# EAGLE schematic snarfb-reza_v00 (EAGLE 6.4)
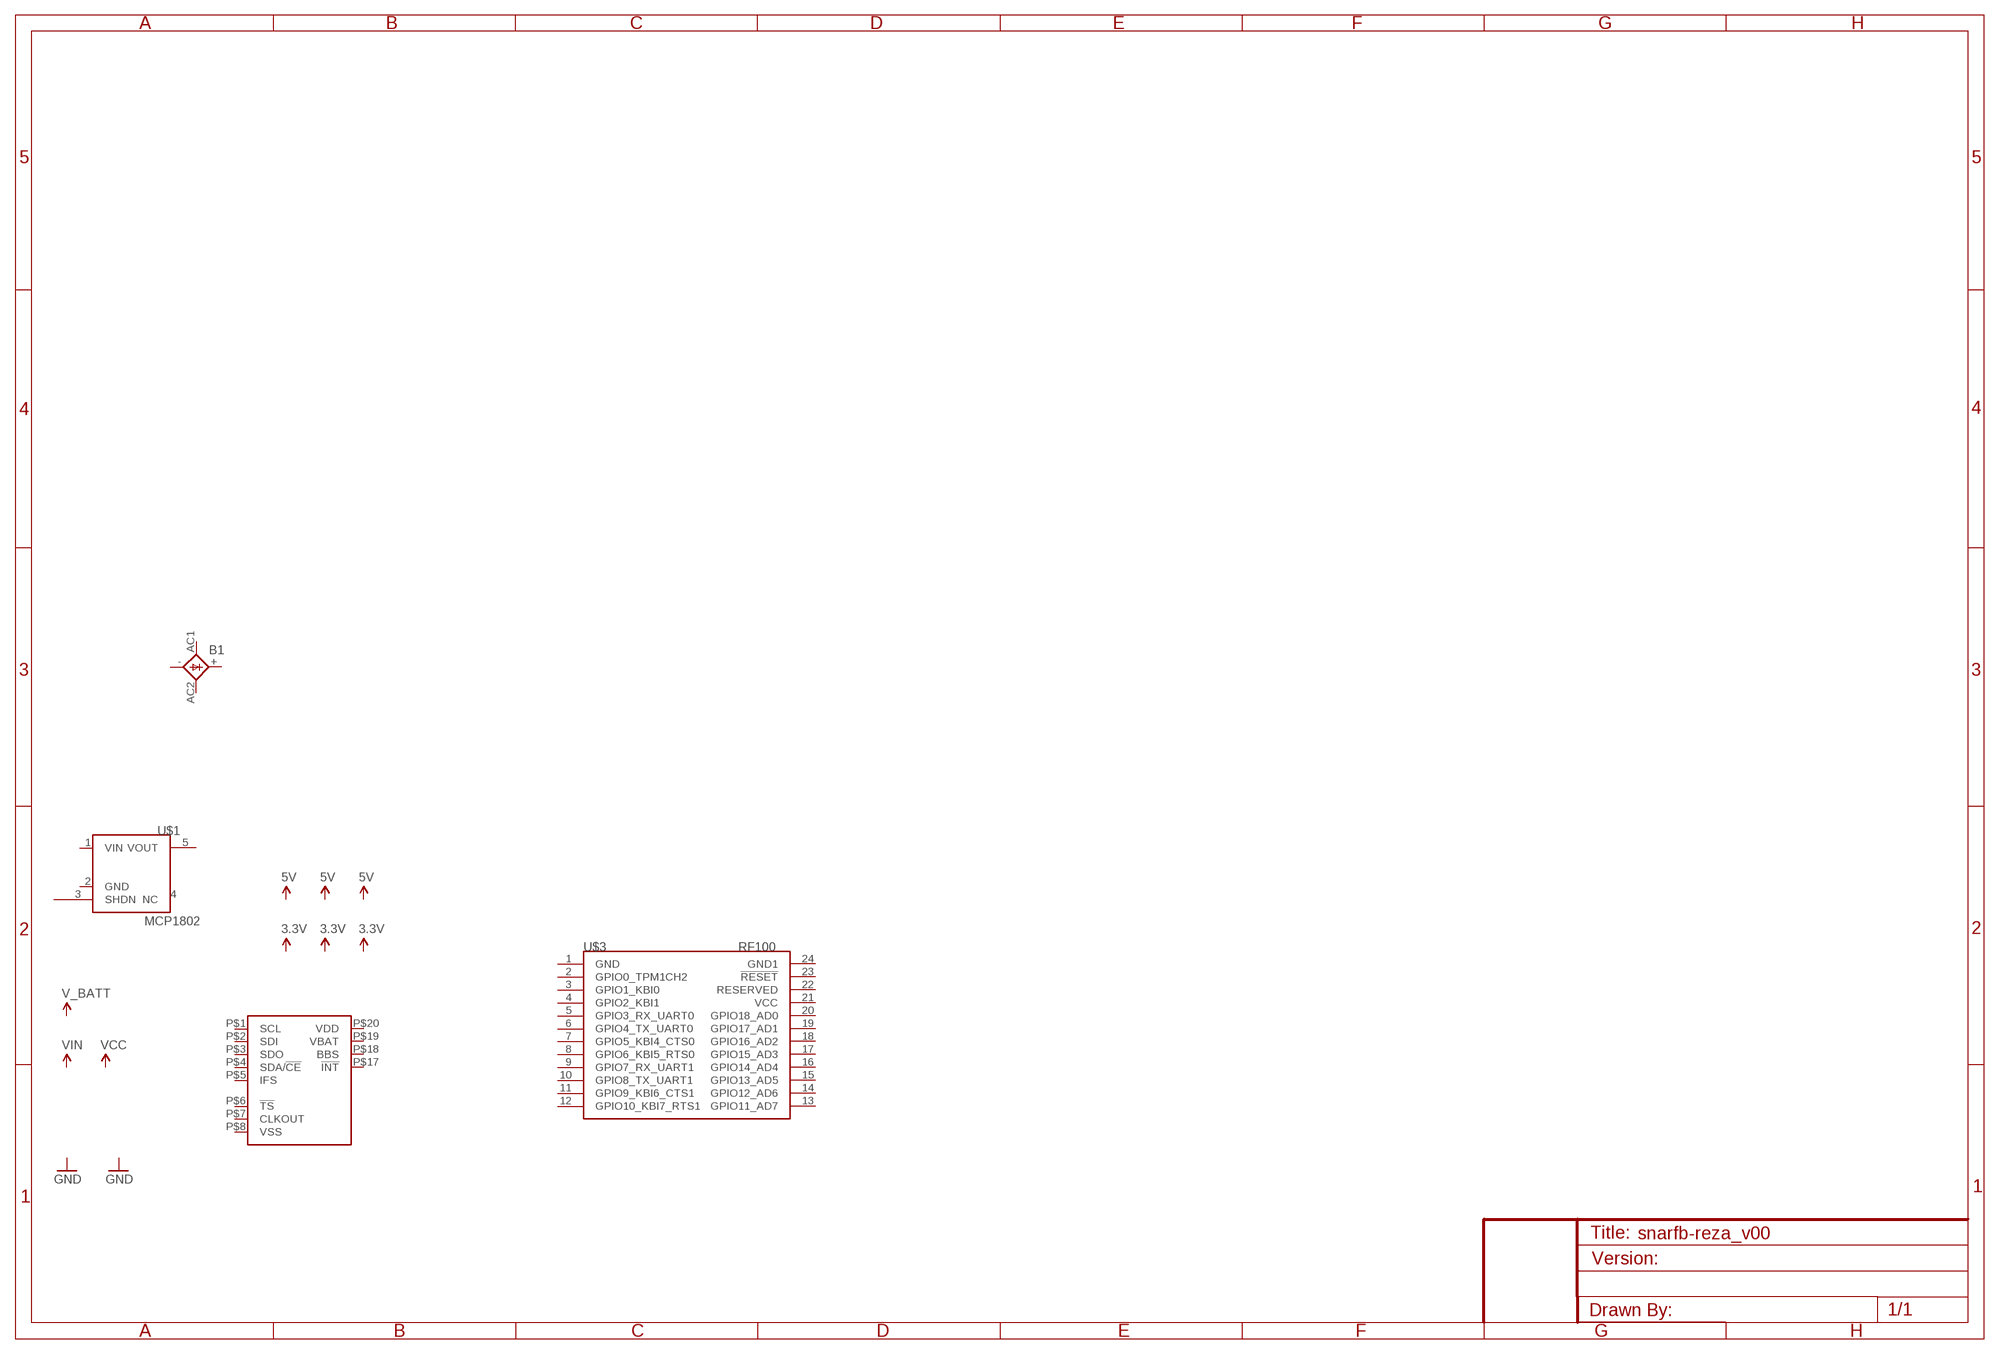
[diagram p0: schematic, sheet 1]

## Parts
B1  1KAB  [1KAB]
U$1  MCP1802  [SOT23-5]
U$2  PCF2129ASO20  [SO20W]
U$3  RF100-JACKJACK2  [SYNAPSERFENGINE-THM-SMT-JACK2]
Unconnected: B1.+ B1.- B1.AC1 B1.AC2 U$1.1(VIN) U$1.2(GND) U$1.3(SHDN) U$1.4(NC) U$1.5(VOUT) U$2.P$1(SCL) U$2.P$2(SDI) U$2.P$3(SDO) U$2.P$4(SDA/!CE) U$2.P$5(IFS) U$2.P$6(!TS) U$2.P$7(CLKOUT) U$2.P$8(VSS) U$2.P$17(!INT) U$2.P$18(BBS) U$2.P$19(VBAT) U$2.P$20(VDD) U$3.1(GND) U$3.2(GPIO0_TPM1CH2) U$3.3(GPIO1_KBI0) U$3.4(GPIO2_KBI1) U$3.5(GPIO3_RX_UART0) U$3.6(GPIO4_TX_UART0) U$3.7(GPIO5_KBI4_CTS0) U$3.8(GPIO6_KBI5_RTS0) U$3.9(GPIO7_RX_UART1) U$3.10(GPIO8_TX_UART1) U$3.11(GPIO9_KBI6_CTS1) U$3.12(GPIO10_KBI7_RTS1) U$3.13(GPIO11_AD7) U$3.14(GPIO12_AD6) U$3.15(GPIO13_AD5) U$3.16(GPIO14_AD4) U$3.17(GPIO15_AD3) U$3.18(GPIO16_AD2) U$3.19(GPIO17_AD1) U$3.20(GPIO18_AD0) U$3.21(VCC) U$3.22(RESERVED) U$3.23(!RESET) U$3.24(GND1) U$3.P1 U$3.P2 U$3.P3 U$3.P4 U$3.P5 U$3.P6 U$3.P7 U$3.P8 U$3.P9 U$3.P10 U$3.P11 U$3.P12 U$3.P13 U$3.P14 U$3.P15 U$3.P16 U$3.P17 U$3.P18 U$3.P19 U$3.P20 U$3.P21 U$3.P22 U$3.P23 U$3.P24 U$3.P201 U$3.P202 U$3.P203 U$3.P204 U$3.P205 U$3.P206 U$3.P207 U$3.P208 U$3.P209 U$3.P210 U$3.P211 U$3.P212 U$3.P213 U$3.P214 U$3.P215 U$3.P216 U$3.P217 U$3.P218 U$3.P219 U$3.P220 U$3.P221 U$3.P222 U$3.P223 U$3.P224

## Library data of the parts
B1 = rectifier:1KAB: RECTIFIER grid 5,08 x 5,08 mm
U$1 = 0_jc-custom-eagle6:MCP1802
U$2 = 0_jc-custom-eagle6:PCF2129A
U$3 = 0_jc-custom-eagle6:RF100-JACK